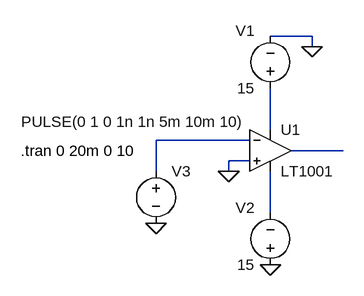
[diagram p0: schematic LT1001_lab2_q3d.asc]
LT1001_lab2_q3d.asc, the LTspice schematic file:
Version 4
SHEET 1 880 680
WIRE 144 80 80 80
WIRE 144 96 144 80
WIRE 80 224 80 160
WIRE 48 240 -96 240
WIRE 192 256 112 256
WIRE 48 272 16 272
WIRE -96 288 -96 240
WIRE 16 288 16 272
WIRE 80 352 80 288
FLAG 144 96 0
FLAG 80 432 0
FLAG -96 368 0
FLAG 16 288 0
SYMBOL Opamps\\LT1001 80 192 R0
SYMATTR InstName U1
SYMBOL voltage 80 176 R180
WINDOW 0 24 104 Left 0
WINDOW 3 24 16 Left 0
WINDOW 123 0 0 Left 0
WINDOW 39 0 0 Left 0
SYMATTR InstName V1
SYMATTR Value 15
SYMBOL voltage 80 448 R180
WINDOW 0 24 104 Left 0
WINDOW 3 24 16 Left 0
WINDOW 123 0 0 Left 0
WINDOW 39 0 0 Left 0
SYMATTR InstName V2
SYMATTR Value 15
SYMBOL voltage -96 272 R0
WINDOW 3 -207 -60 Left 0
WINDOW 123 0 0 Left 0
WINDOW 39 0 0 Left 0
SYMATTR Value PULSE(0 1 0 1n 1n 5m 10m 10)
SYMATTR InstName V3
TEXT -304 256 Left 0 !.tran 0 20m 0 10

The netlist it stands for:
* LT1001_lab2_q3d.asc
XU1 0 N002 N001 N004 N003 LT1001  ; pins In+ In- V+ V- OUT
V1 N001 0 15
V2 0 N004 15
V3 N002 0 PULSE(0 1 0 1n 1n 5m 10m 10)
.tran 0 20m 0 10
.lib LTC.lib
.backanno
.end